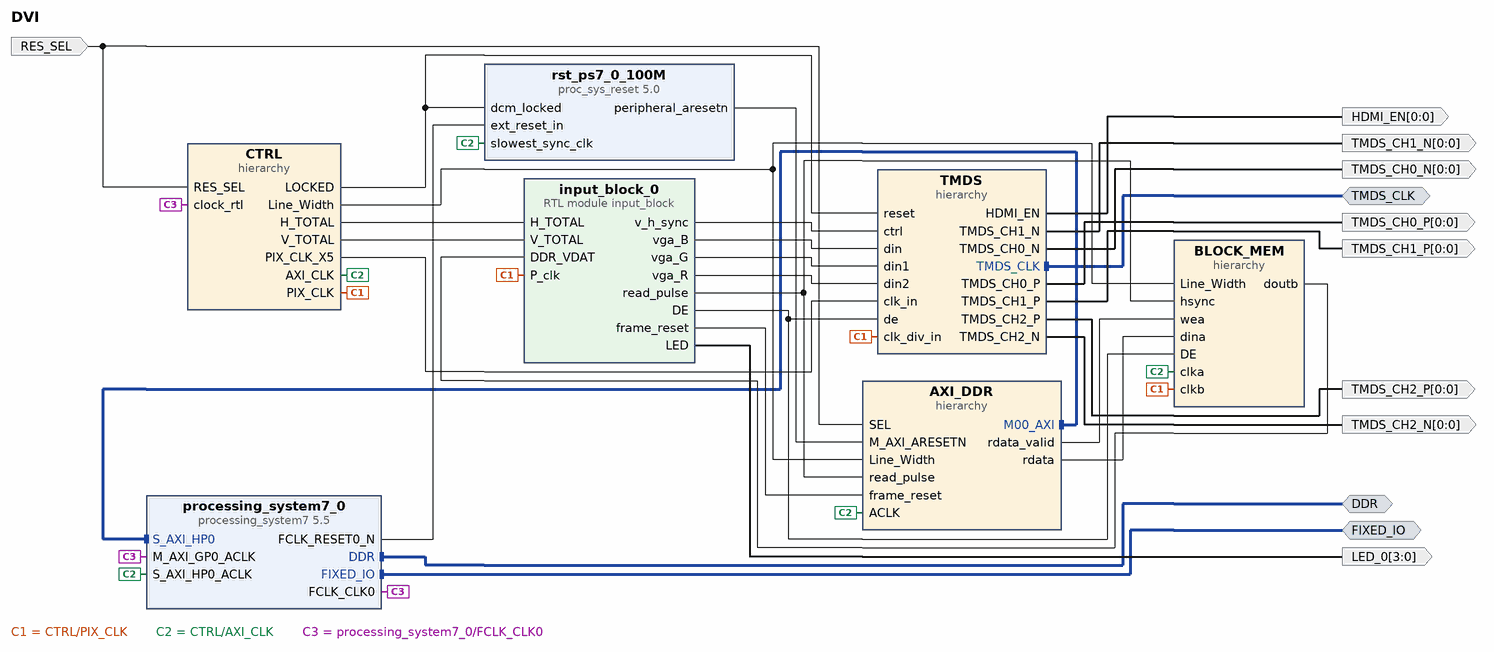
[diagram p0: block diagram of the top level]
# Vivado block design DVI, xc7z010clg400-1, Vivado 2019.2
create_bd_design DVI

create_bd_intf_port -mode Master -vlnv xilinx.com:interface:diff_clock_rtl:1.0 TMDS_CLK
create_bd_intf_port -mode Master -vlnv xilinx.com:display_processing_system7:fixedio_rtl:1.0 FIXED_IO
create_bd_intf_port -mode Master -vlnv xilinx.com:interface:ddrx_rtl:1.0 DDR
create_bd_port -dir O -from 0 -to 0 HDMI_EN
create_bd_port -dir O -from 0 -to 0 TMDS_CH0_N
create_bd_port -dir O -from 0 -to 0 TMDS_CH0_P
create_bd_port -dir O -from 0 -to 0 TMDS_CH1_N
create_bd_port -dir O -from 0 -to 0 TMDS_CH1_P
create_bd_port -dir O -from 0 -to 0 TMDS_CH2_N
create_bd_port -dir O -from 0 -to 0 TMDS_CH2_P
create_bd_port -dir O -from 3 -to 0 LED_0
create_bd_port -dir I -type intr RES_SEL

create_bd_cell -type hier BLOCK_MEM
create_bd_cell -type hier TMDS
create_bd_cell -type hier AXI_DDR
create_bd_cell -type ip -vlnv xilinx.com:ip:processing_system7:5.5 processing_system7_0
set_property -dict [list \
  CONFIG.PCW_APU_PERIPHERAL_FREQMHZ 650 \
  CONFIG.PCW_CRYSTAL_PERIPHERAL_FREQMHZ 50.000000 \
  CONFIG.PCW_ENET0_ENET0_IO {MIO 16 .. 27} \
  CONFIG.PCW_ENET0_GRP_MDIO_ENABLE 1 \
  CONFIG.PCW_ENET0_GRP_MDIO_IO {MIO 52 .. 53} \
  CONFIG.PCW_ENET0_PERIPHERAL_ENABLE 1 \
  CONFIG.PCW_ENET0_RESET_ENABLE 0 \
  CONFIG.PCW_ENET_RESET_ENABLE 1 \
  CONFIG.PCW_ENET_RESET_SELECT {Share reset pin} \
  CONFIG.PCW_FPGA0_PERIPHERAL_FREQMHZ 100 \
  CONFIG.PCW_FPGA1_PERIPHERAL_FREQMHZ 50 \
  CONFIG.PCW_GP0_EN_MODIFIABLE_TXN 0 \
  CONFIG.PCW_GP1_EN_MODIFIABLE_TXN 0 \
  CONFIG.PCW_GPIO_MIO_GPIO_ENABLE 1 \
  CONFIG.PCW_GPIO_MIO_GPIO_IO MIO \
  CONFIG.PCW_I2C_RESET_ENABLE 1 \
  CONFIG.PCW_PERIPHERAL_BOARD_PRESET part0 \
  CONFIG.PCW_PRESET_BANK1_VOLTAGE {LVCMOS 1.8V} \
  CONFIG.PCW_QSPI_GRP_FBCLK_ENABLE 1 \
  CONFIG.PCW_QSPI_GRP_FBCLK_IO {MIO 8} \
  CONFIG.PCW_QSPI_GRP_SINGLE_SS_ENABLE 1 \
  CONFIG.PCW_QSPI_GRP_SINGLE_SS_IO {MIO 1 .. 6} \
  CONFIG.PCW_QSPI_PERIPHERAL_ENABLE 1 \
  CONFIG.PCW_QSPI_QSPI_IO {MIO 1 .. 6} \
  CONFIG.PCW_SD0_GRP_CD_ENABLE 0 \
  CONFIG.PCW_SD0_GRP_WP_ENABLE 1 \
  CONFIG.PCW_SD0_GRP_WP_IO EMIO \
  CONFIG.PCW_SD0_PERIPHERAL_ENABLE 1 \
  CONFIG.PCW_SD0_SD0_IO {MIO 40 .. 45} \
  CONFIG.PCW_SDIO_PERIPHERAL_FREQMHZ 50 \
  CONFIG.PCW_SINGLE_QSPI_DATA_MODE x4 \
  CONFIG.PCW_S_AXI_HP0_DATA_WIDTH 32 \
  CONFIG.PCW_TTC0_PERIPHERAL_ENABLE 1 \
  CONFIG.PCW_TTC0_TTC0_IO EMIO \
  CONFIG.PCW_UART1_PERIPHERAL_ENABLE 1 \
  CONFIG.PCW_UART1_UART1_IO {MIO 48 .. 49} \
  CONFIG.PCW_UART_PERIPHERAL_FREQMHZ 100 \
  CONFIG.PCW_UIPARAM_DDR_FREQ_MHZ 525 \
  CONFIG.PCW_UIPARAM_DDR_PARTNO {MT41K128M16 JT-125} \
  CONFIG.PCW_USB0_PERIPHERAL_ENABLE 1 \
  CONFIG.PCW_USB0_RESET_ENABLE 1 \
  CONFIG.PCW_USB0_RESET_IO {MIO 46} \
  CONFIG.PCW_USB0_USB0_IO {MIO 28 .. 39} \
  CONFIG.PCW_USB_RESET_ENABLE 1 \
  CONFIG.PCW_USB_RESET_SELECT {Share reset pin} \
  CONFIG.PCW_USE_S_AXI_HP0 1 \
] [get_bd_cells processing_system7_0]
# 503 more settings of processing_system7_0 are not shown: defaults, MIO pin electricals, DDR timing, and values the tool derives
create_bd_cell -type ip -vlnv xilinx.com:ip:proc_sys_reset:5.0 rst_ps7_0_100M
create_bd_cell -type hier CTRL
create_bd_cell -type module -reference input_block input_block_0

# ---- hierarchy /BLOCK_MEM ----
current_bd_instance /BLOCK_MEM
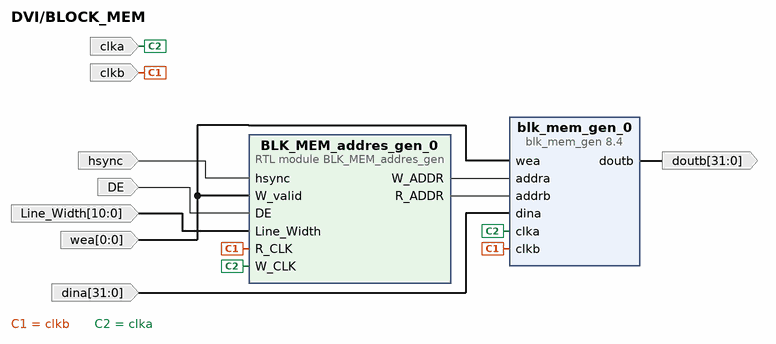
[diagram p1: block diagram inside /BLOCK_MEM]
create_bd_pin -dir O -from 31 -to 0 doutb
create_bd_pin -dir I -type clk clkb
create_bd_pin -dir I -type clk clka
create_bd_pin -dir I -from 31 -to 0 dina
create_bd_pin -dir I -from 0 -to 0 wea
create_bd_pin -dir I hsync
create_bd_pin -dir I DE
create_bd_pin -dir I -from 10 -to 0 Line_Width

create_bd_cell -type ip -vlnv xilinx.com:ip:blk_mem_gen:8.4 blk_mem_gen_0
set_property -dict [list \
  CONFIG.Enable_32bit_Address false \
  CONFIG.Enable_A Always_Enabled \
  CONFIG.Enable_B Always_Enabled \
  CONFIG.Memory_Type Simple_Dual_Port_RAM \
  CONFIG.Operating_Mode_A WRITE_FIRST \
  CONFIG.Port_B_Clock 100 \
  CONFIG.Port_B_Enable_Rate 100 \
  CONFIG.Read_Width_B 32 \
  CONFIG.Register_PortB_Output_of_Memory_Primitives true \
  CONFIG.Use_Byte_Write_Enable false \
  CONFIG.Write_Depth_A 1280 \
  CONFIG.Write_Width_A 32 \
  CONFIG.Write_Width_B 32 \
  CONFIG.use_bram_block Stand_Alone \
] [get_bd_cells blk_mem_gen_0]
create_bd_cell -type module -reference BLK_MEM_addres_gen BLK_MEM_addres_gen_0

# ---- hierarchy /TMDS ----
current_bd_instance /TMDS
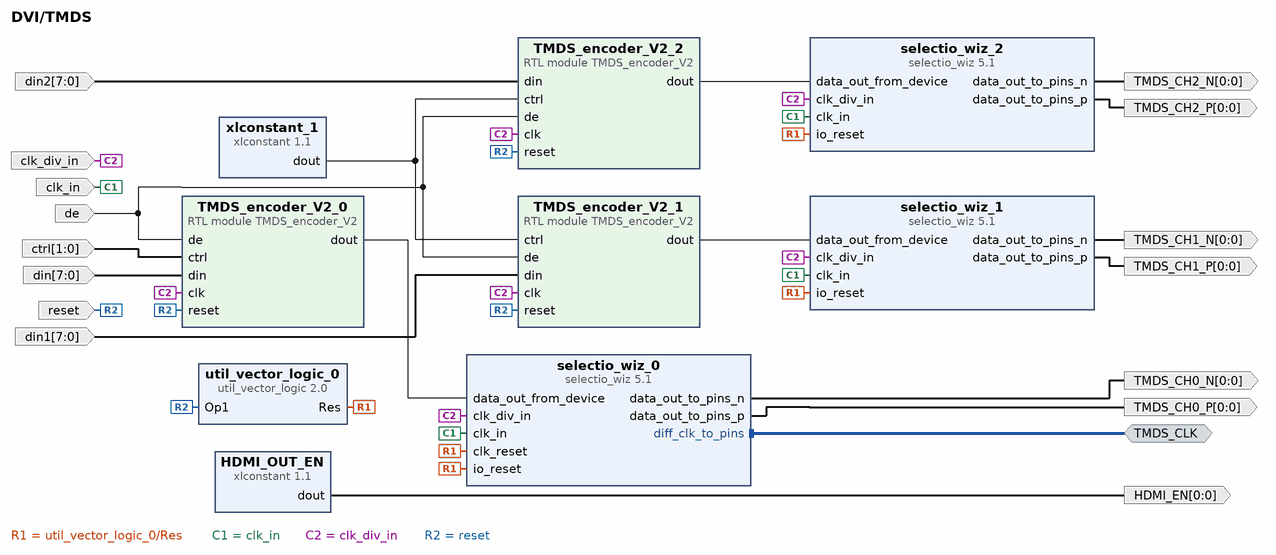
[diagram p2: block diagram inside /TMDS]
create_bd_intf_pin -mode Master -vlnv xilinx.com:interface:diff_clock_rtl:1.0 TMDS_CLK
create_bd_pin -dir O -from 0 -to 0 TMDS_CH2_P
create_bd_pin -dir O -from 0 -to 0 TMDS_CH2_N
create_bd_pin -dir I -type clk clk_in
create_bd_pin -dir I clk_div_in
create_bd_pin -dir I -type rst reset
create_bd_pin -dir I de
create_bd_pin -dir I -from 1 -to 0 ctrl
create_bd_pin -dir I -from 7 -to 0 din
create_bd_pin -dir I -from 7 -to 0 din1
create_bd_pin -dir I -from 7 -to 0 din2
create_bd_pin -dir O -from 0 -to 0 TMDS_CH0_P
create_bd_pin -dir O -from 0 -to 0 TMDS_CH0_N
create_bd_pin -dir O -from 0 -to 0 TMDS_CH1_P
create_bd_pin -dir O -from 0 -to 0 TMDS_CH1_N
create_bd_pin -dir O -from 0 -to 0 HDMI_EN

create_bd_cell -type ip -vlnv xilinx.com:ip:selectio_wiz:5.1 selectio_wiz_2
set_property -dict [list \
  CONFIG.BUS_DIR OUTPUTS \
  CONFIG.BUS_IO_STD TMDS_33 \
  CONFIG.BUS_SIG_TYPE DIFF \
  CONFIG.CLK_FWD false \
  CONFIG.CLK_FWD_IO_STD TMDS_33 \
  CONFIG.CLK_FWD_SIG_TYPE DIFF \
  CONFIG.SELIO_ACTIVE_EDGE DDR \
  CONFIG.SELIO_BUS_IN_DELAY NONE \
  CONFIG.SELIO_CLK_BUF MMCM \
  CONFIG.SELIO_CLK_IO_STD TMDS_33 \
  CONFIG.SELIO_CLK_SIG_TYPE DIFF \
  CONFIG.SELIO_INTERFACE_TYPE NETWORKING \
  CONFIG.SERIALIZATION_FACTOR 10 \
  CONFIG.SYSTEM_DATA_WIDTH 1 \
  CONFIG.USE_SERIALIZATION true \
] [get_bd_cells selectio_wiz_2]
create_bd_cell -type ip -vlnv xilinx.com:ip:util_vector_logic:2.0 util_vector_logic_0
set_property -dict {CONFIG.C_OPERATION not CONFIG.C_SIZE 1} [get_bd_cells util_vector_logic_0]
create_bd_cell -type ip -vlnv xilinx.com:ip:xlconstant:1.1 xlconstant_1
set_property -dict {CONFIG.CONST_VAL 00 CONFIG.CONST_WIDTH 2} [get_bd_cells xlconstant_1]
create_bd_cell -type module -reference TMDS_encoder_V2 TMDS_encoder_V2_0
create_bd_cell -type module -reference TMDS_encoder_V2 TMDS_encoder_V2_1
create_bd_cell -type module -reference TMDS_encoder_V2 TMDS_encoder_V2_2
create_bd_cell -type ip -vlnv xilinx.com:ip:selectio_wiz:5.1 selectio_wiz_0
set_property -dict [list \
  CONFIG.BUS_DIR OUTPUTS \
  CONFIG.BUS_IO_STD TMDS_33 \
  CONFIG.BUS_SIG_TYPE DIFF \
  CONFIG.CLK_FWD true \
  CONFIG.CLK_FWD_IO_STD TMDS_33 \
  CONFIG.CLK_FWD_SER true \
  CONFIG.CLK_FWD_SIG_TYPE DIFF \
  CONFIG.SELIO_ACTIVE_EDGE DDR \
  CONFIG.SELIO_BUS_IN_DELAY NONE \
  CONFIG.SELIO_CLK_BUF MMCM \
  CONFIG.SELIO_CLK_IO_STD TMDS_33 \
  CONFIG.SELIO_CLK_SIG_TYPE DIFF \
  CONFIG.SELIO_INTERFACE_TYPE NETWORKING \
  CONFIG.SERIALIZATION_FACTOR 10 \
  CONFIG.SYSTEM_DATA_WIDTH 1 \
  CONFIG.USE_SERIALIZATION true \
] [get_bd_cells selectio_wiz_0]
create_bd_cell -type ip -vlnv xilinx.com:ip:selectio_wiz:5.1 selectio_wiz_1
set_property -dict [list \
  CONFIG.BUS_DIR OUTPUTS \
  CONFIG.BUS_IO_STD TMDS_33 \
  CONFIG.BUS_SIG_TYPE DIFF \
  CONFIG.CLK_FWD false \
  CONFIG.CLK_FWD_IO_STD TMDS_33 \
  CONFIG.CLK_FWD_SIG_TYPE DIFF \
  CONFIG.SELIO_ACTIVE_EDGE DDR \
  CONFIG.SELIO_BUS_IN_DELAY NONE \
  CONFIG.SELIO_CLK_BUF MMCM \
  CONFIG.SELIO_CLK_IO_STD TMDS_33 \
  CONFIG.SELIO_CLK_SIG_TYPE DIFF \
  CONFIG.SELIO_INTERFACE_TYPE NETWORKING \
  CONFIG.SERIALIZATION_FACTOR 10 \
  CONFIG.SYSTEM_DATA_WIDTH 1 \
  CONFIG.USE_SERIALIZATION true \
] [get_bd_cells selectio_wiz_1]
create_bd_cell -type ip -vlnv xilinx.com:ip:xlconstant:1.1 HDMI_OUT_EN

# ---- hierarchy /AXI_DDR ----
current_bd_instance /AXI_DDR
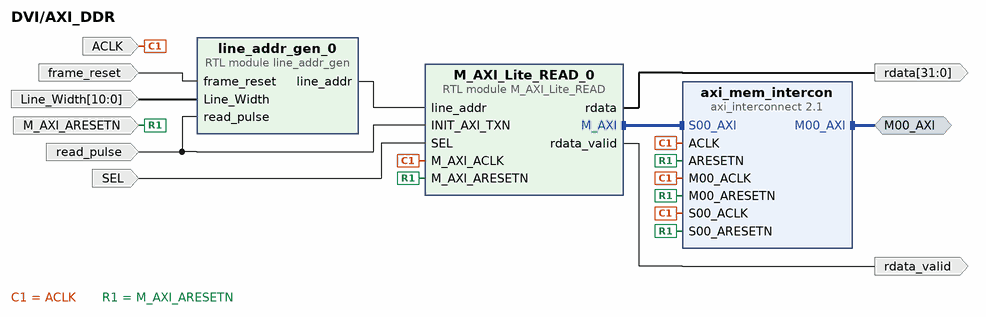
[diagram p3: block diagram inside /AXI_DDR]
create_bd_intf_pin -mode Master -vlnv xilinx.com:interface:aximm_rtl:1.0 M00_AXI
create_bd_pin -dir I -type rst frame_reset
create_bd_pin -dir I -type rst M_AXI_ARESETN
create_bd_pin -dir I -type clk ACLK
create_bd_pin -dir O -from 31 -to 0 rdata
create_bd_pin -dir O rdata_valid
create_bd_pin -dir I read_pulse
create_bd_pin -dir I -from 10 -to 0 Line_Width
create_bd_pin -dir I SEL

create_bd_cell -type ip -vlnv xilinx.com:ip:axi_interconnect:2.1 axi_mem_intercon
set_property -dict {CONFIG.NUM_MI 1} [get_bd_cells axi_mem_intercon]
create_bd_cell -type module -reference line_addr_gen line_addr_gen_0
create_bd_cell -type module -reference M_AXI_Lite_READ M_AXI_Lite_READ_0
set_property -dict {CONFIG.C_M_AXI_DATA_WIDTH 32 CONFIG.C_M_BURST_LEN 128} [get_bd_cells M_AXI_Lite_READ_0]

# ---- hierarchy /CTRL ----
current_bd_instance /CTRL
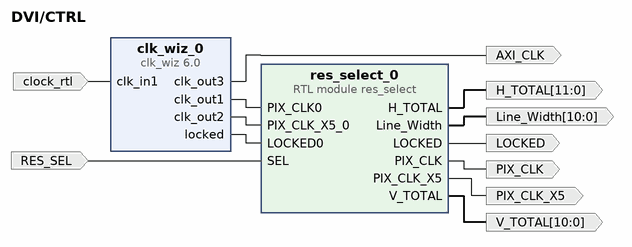
[diagram p4: block diagram inside /CTRL]
create_bd_pin -dir O -type clk AXI_CLK
create_bd_pin -dir O -type clk PIX_CLK
create_bd_pin -dir O PIX_CLK_X5
create_bd_pin -dir O LOCKED
create_bd_pin -dir O -from 10 -to 0 Line_Width
create_bd_pin -dir O -from 11 -to 0 H_TOTAL
create_bd_pin -dir O -from 10 -to 0 V_TOTAL
create_bd_pin -dir I -type clk clock_rtl
create_bd_pin -dir I RES_SEL

create_bd_cell -type module -reference res_select res_select_0
create_bd_cell -type ip -vlnv xilinx.com:ip:clk_wiz:6.0 clk_wiz_0
set_property -dict [list \
  CONFIG.CLKOUT1_DRIVES BUFG \
  CONFIG.CLKOUT1_JITTER 230.405 \
  CONFIG.CLKOUT1_PHASE_ERROR 317.963 \
  CONFIG.CLKOUT1_REQUESTED_OUT_FREQ 25.2 \
  CONFIG.CLKOUT2_DRIVES BUFG \
  CONFIG.CLKOUT2_JITTER 184.176 \
  CONFIG.CLKOUT2_PHASE_ERROR 317.963 \
  CONFIG.CLKOUT2_REQUESTED_OUT_FREQ 126 \
  CONFIG.CLKOUT2_USED true \
  CONFIG.CLKOUT3_DRIVES BUFG \
  CONFIG.CLKOUT3_JITTER 168.070 \
  CONFIG.CLKOUT3_PHASE_ERROR 317.963 \
  CONFIG.CLKOUT3_REQUESTED_OUT_FREQ 250 \
  CONFIG.CLKOUT3_USED true \
  CONFIG.CLKOUT4_DRIVES BUFG \
  CONFIG.CLKOUT5_DRIVES BUFG \
  CONFIG.CLKOUT6_DRIVES BUFG \
  CONFIG.CLKOUT7_DRIVES BUFG \
  CONFIG.CLK_IN1_BOARD_INTERFACE Custom \
  CONFIG.MMCM_BANDWIDTH OPTIMIZED \
  CONFIG.MMCM_CLKFBOUT_MULT_F 63 \
  CONFIG.MMCM_CLKIN1_PERIOD 10.000 \
  CONFIG.MMCM_CLKIN2_PERIOD 10.000 \
  CONFIG.MMCM_CLKOUT0_DIVIDE_F 50 \
  CONFIG.MMCM_CLKOUT1_DIVIDE 10 \
  CONFIG.MMCM_CLKOUT2_DIVIDE 5 \
  CONFIG.MMCM_COMPENSATION INTERNAL \
  CONFIG.MMCM_DIVCLK_DIVIDE 5 \
  CONFIG.NUM_OUT_CLKS 3 \
  CONFIG.OVERRIDE_MMCM true \
  CONFIG.PRIMITIVE PLL \
  CONFIG.USE_BOARD_FLOW true \
  CONFIG.USE_LOCKED true \
  CONFIG.USE_RESET false \
] [get_bd_cells clk_wiz_0]

# ---- connections ----

current_bd_instance /BLOCK_MEM
connect_bd_net -net PL_HDMI_PIX_CLK_PH_0 [get_bd_pins clkb] [get_bd_pins blk_mem_gen_0/clkb] [get_bd_pins BLK_MEM_addres_gen_0/R_CLK]
connect_bd_net -net ACLK_1 [get_bd_pins clka] [get_bd_pins blk_mem_gen_0/clka] [get_bd_pins BLK_MEM_addres_gen_0/W_CLK]
connect_bd_net -net M_AXI_Lite_READ_0_rdata_valid [get_bd_pins wea] [get_bd_pins blk_mem_gen_0/wea] [get_bd_pins BLK_MEM_addres_gen_0/W_valid]
connect_bd_net -net M_AXI_Lite_READ_0_rdata [get_bd_pins dina] [get_bd_pins blk_mem_gen_0/dina]
connect_bd_net [get_bd_pins blk_mem_gen_0/doutb] [get_bd_pins doutb]
connect_bd_net [get_bd_pins BLK_MEM_addres_gen_0/W_ADDR] [get_bd_pins blk_mem_gen_0/addra]
connect_bd_net [get_bd_pins BLK_MEM_addres_gen_0/R_ADDR] [get_bd_pins blk_mem_gen_0/addrb]
connect_bd_net [get_bd_pins hsync] [get_bd_pins BLK_MEM_addres_gen_0/hsync]
connect_bd_net [get_bd_pins DE] [get_bd_pins BLK_MEM_addres_gen_0/DE]
connect_bd_net [get_bd_pins Line_Width] [get_bd_pins BLK_MEM_addres_gen_0/Line_Width]

current_bd_instance /TMDS
connect_bd_intf_net -intf_net PL_HDMI_TMDS_CLK [get_bd_intf_pins TMDS_CLK] [get_bd_intf_pins selectio_wiz_0/diff_clk_to_pins]
connect_bd_net [get_bd_pins TMDS_encoder_V2_2/dout] [get_bd_pins selectio_wiz_2/data_out_from_device]
connect_bd_net [get_bd_pins util_vector_logic_0/Res] \
  [get_bd_pins selectio_wiz_0/io_reset] [get_bd_pins selectio_wiz_0/clk_reset] [get_bd_pins selectio_wiz_2/io_reset] \
  [get_bd_pins selectio_wiz_1/io_reset]
connect_bd_net [get_bd_pins xlconstant_1/dout] [get_bd_pins TMDS_encoder_V2_1/ctrl] [get_bd_pins TMDS_encoder_V2_2/ctrl]
connect_bd_net [get_bd_pins TMDS_encoder_V2_0/dout] [get_bd_pins selectio_wiz_0/data_out_from_device]
connect_bd_net [get_bd_pins TMDS_encoder_V2_1/dout] [get_bd_pins selectio_wiz_1/data_out_from_device]
connect_bd_net -net PL_HDMI_TMDS_CH2_P [get_bd_pins selectio_wiz_2/data_out_to_pins_p] [get_bd_pins TMDS_CH2_P]
connect_bd_net -net PL_HDMI_TMDS_CH2_N [get_bd_pins selectio_wiz_2/data_out_to_pins_n] [get_bd_pins TMDS_CH2_N]
connect_bd_net -net res_select_0_PIX_CLK_X5 [get_bd_pins clk_in] \
  [get_bd_pins selectio_wiz_0/clk_in] [get_bd_pins selectio_wiz_1/clk_in] [get_bd_pins selectio_wiz_2/clk_in]
connect_bd_net -net res_select_0_PIX_CLK [get_bd_pins clk_div_in] \
  [get_bd_pins selectio_wiz_0/clk_div_in] [get_bd_pins selectio_wiz_1/clk_div_in] [get_bd_pins TMDS_encoder_V2_0/clk] \
  [get_bd_pins TMDS_encoder_V2_1/clk] [get_bd_pins TMDS_encoder_V2_2/clk] [get_bd_pins selectio_wiz_2/clk_div_in]
connect_bd_net -net res_select_0_LOCKED [get_bd_pins reset] \
  [get_bd_pins TMDS_encoder_V2_0/reset] [get_bd_pins TMDS_encoder_V2_1/reset] [get_bd_pins TMDS_encoder_V2_2/reset] \
  [get_bd_pins util_vector_logic_0/Op1]
connect_bd_net -net input_block_0_DE_TMDS [get_bd_pins de] \
  [get_bd_pins TMDS_encoder_V2_1/de] [get_bd_pins TMDS_encoder_V2_2/de] [get_bd_pins TMDS_encoder_V2_0/de]
connect_bd_net -net input_block_0_v_h_sync [get_bd_pins ctrl] [get_bd_pins TMDS_encoder_V2_0/ctrl]
connect_bd_net -net input_block_0_vga_B [get_bd_pins din] [get_bd_pins TMDS_encoder_V2_0/din]
connect_bd_net -net input_block_0_vga_G [get_bd_pins din1] [get_bd_pins TMDS_encoder_V2_1/din]
connect_bd_net -net input_block_0_vga_R [get_bd_pins din2] [get_bd_pins TMDS_encoder_V2_2/din]
connect_bd_net -net PL_HDMI_TMDS_CH0_P [get_bd_pins selectio_wiz_0/data_out_to_pins_p] [get_bd_pins TMDS_CH0_P]
connect_bd_net -net PL_HDMI_TMDS_CH0_N [get_bd_pins selectio_wiz_0/data_out_to_pins_n] [get_bd_pins TMDS_CH0_N]
connect_bd_net -net PL_HDMI_TMDS_CH1_P [get_bd_pins selectio_wiz_1/data_out_to_pins_p] [get_bd_pins TMDS_CH1_P]
connect_bd_net -net PL_HDMI_TMDS_CH1_N [get_bd_pins selectio_wiz_1/data_out_to_pins_n] [get_bd_pins TMDS_CH1_N]
connect_bd_net -net PL_HDMI_HDMI_EN [get_bd_pins HDMI_OUT_EN/dout] [get_bd_pins HDMI_EN]

current_bd_instance /AXI_DDR
connect_bd_intf_net [get_bd_intf_pins M_AXI_Lite_READ_0/M_AXI] [get_bd_intf_pins axi_mem_intercon/S00_AXI]
connect_bd_intf_net [get_bd_intf_pins M00_AXI] [get_bd_intf_pins axi_mem_intercon/M00_AXI]
connect_bd_net [get_bd_pins line_addr_gen_0/line_addr] [get_bd_pins M_AXI_Lite_READ_0/line_addr]
connect_bd_net -net PL_HDMI_frame_reset [get_bd_pins frame_reset] [get_bd_pins line_addr_gen_0/frame_reset]
connect_bd_net [get_bd_pins ACLK] \
  [get_bd_pins axi_mem_intercon/ACLK] [get_bd_pins axi_mem_intercon/S00_ACLK] [get_bd_pins axi_mem_intercon/M00_ACLK] \
  [get_bd_pins M_AXI_Lite_READ_0/M_AXI_ACLK]
connect_bd_net [get_bd_pins M_AXI_Lite_READ_0/rdata] [get_bd_pins rdata]
connect_bd_net [get_bd_pins M_AXI_Lite_READ_0/rdata_valid] [get_bd_pins rdata_valid]
connect_bd_net [get_bd_pins read_pulse] [get_bd_pins line_addr_gen_0/read_pulse] [get_bd_pins M_AXI_Lite_READ_0/INIT_AXI_TXN]
connect_bd_net -net res_select_0_LOCKED [get_bd_pins M_AXI_ARESETN] \
  [get_bd_pins axi_mem_intercon/S00_ARESETN] [get_bd_pins axi_mem_intercon/M00_ARESETN] \
  [get_bd_pins axi_mem_intercon/ARESETN] [get_bd_pins M_AXI_Lite_READ_0/M_AXI_ARESETN]
connect_bd_net [get_bd_pins Line_Width] [get_bd_pins line_addr_gen_0/Line_Width]
connect_bd_net -net RES_SEL_1 [get_bd_pins SEL] [get_bd_pins M_AXI_Lite_READ_0/SEL]

current_bd_instance /CTRL
connect_bd_net [get_bd_pins res_select_0/PIX_CLK] [get_bd_pins PIX_CLK]
connect_bd_net [get_bd_pins res_select_0/PIX_CLK_X5] [get_bd_pins PIX_CLK_X5]
connect_bd_net [get_bd_pins res_select_0/LOCKED] [get_bd_pins LOCKED]
connect_bd_net [get_bd_pins res_select_0/Line_Width] [get_bd_pins Line_Width]
connect_bd_net [get_bd_pins res_select_0/H_TOTAL] [get_bd_pins H_TOTAL]
connect_bd_net [get_bd_pins res_select_0/V_TOTAL] [get_bd_pins V_TOTAL]
connect_bd_net [get_bd_pins clock_rtl] [get_bd_pins clk_wiz_0/clk_in1]
connect_bd_net [get_bd_pins clk_wiz_0/clk_out1] [get_bd_pins res_select_0/PIX_CLK0]
connect_bd_net [get_bd_pins clk_wiz_0/clk_out2] [get_bd_pins res_select_0/PIX_CLK_X5_0]
connect_bd_net [get_bd_pins clk_wiz_0/clk_out3] [get_bd_pins AXI_CLK]
connect_bd_net [get_bd_pins clk_wiz_0/locked] [get_bd_pins res_select_0/LOCKED0]
connect_bd_net [get_bd_pins RES_SEL] [get_bd_pins res_select_0/SEL]

current_bd_instance /
connect_bd_intf_net [get_bd_intf_ports DDR] [get_bd_intf_pins processing_system7_0/DDR]
connect_bd_intf_net -intf_net PL_HDMI_TMDS_CLK [get_bd_intf_ports TMDS_CLK] [get_bd_intf_pins TMDS/TMDS_CLK]
connect_bd_intf_net -intf_net axi_mem_intercon_M00_AXI [get_bd_intf_pins AXI_DDR/M00_AXI] [get_bd_intf_pins processing_system7_0/S_AXI_HP0]
connect_bd_intf_net [get_bd_intf_ports FIXED_IO] [get_bd_intf_pins processing_system7_0/FIXED_IO]
connect_bd_net -net PL_HDMI_HDMI_EN [get_bd_pins TMDS/HDMI_EN] [get_bd_ports HDMI_EN]
connect_bd_net -net PL_HDMI_TMDS_CH1_N [get_bd_pins TMDS/TMDS_CH1_N] [get_bd_ports TMDS_CH1_N]
connect_bd_net -net PL_HDMI_TMDS_CH1_P [get_bd_pins TMDS/TMDS_CH1_P] [get_bd_ports TMDS_CH1_P]
connect_bd_net -net PL_HDMI_TMDS_CH2_P [get_bd_pins TMDS/TMDS_CH2_P] [get_bd_ports TMDS_CH2_P]
connect_bd_net -net PL_HDMI_TMDS_CH0_P [get_bd_pins TMDS/TMDS_CH0_P] [get_bd_ports TMDS_CH0_P]
connect_bd_net -net PL_HDMI_TMDS_CH0_N [get_bd_pins TMDS/TMDS_CH0_N] [get_bd_ports TMDS_CH0_N]
connect_bd_net -net PL_HDMI_TMDS_CH2_N [get_bd_pins TMDS/TMDS_CH2_N] [get_bd_ports TMDS_CH2_N]
connect_bd_net -net PL_HDMI_LED_0 [get_bd_pins input_block_0/LED] [get_bd_ports LED_0]
connect_bd_net -net blk_mem_gen_0_doutb [get_bd_pins BLOCK_MEM/doutb] [get_bd_pins input_block_0/DDR_VDAT]
connect_bd_net -net M_AXI_Lite_READ_0_rdata_valid [get_bd_pins AXI_DDR/rdata_valid] [get_bd_pins BLOCK_MEM/wea]
connect_bd_net -net PL_HDMI_frame_reset [get_bd_pins input_block_0/frame_reset] [get_bd_pins AXI_DDR/frame_reset]
connect_bd_net -net res_select_0_PIX_CLK [get_bd_pins CTRL/PIX_CLK] \
  [get_bd_pins BLOCK_MEM/clkb] [get_bd_pins TMDS/clk_div_in] [get_bd_pins input_block_0/P_clk]
connect_bd_net [get_bd_pins input_block_0/v_h_sync] [get_bd_pins TMDS/ctrl]
connect_bd_net [get_bd_pins input_block_0/vga_B] [get_bd_pins TMDS/din]
connect_bd_net [get_bd_pins input_block_0/vga_G] [get_bd_pins TMDS/din1]
connect_bd_net [get_bd_pins input_block_0/vga_R] [get_bd_pins TMDS/din2]
connect_bd_net [get_bd_pins input_block_0/DE] [get_bd_pins BLOCK_MEM/DE] [get_bd_pins TMDS/de]
connect_bd_net [get_bd_pins input_block_0/read_pulse] [get_bd_pins AXI_DDR/read_pulse] [get_bd_pins BLOCK_MEM/hsync]
connect_bd_net -net M_AXI_Lite_READ_0_rdata [get_bd_pins AXI_DDR/rdata] [get_bd_pins BLOCK_MEM/dina]
connect_bd_net [get_bd_pins processing_system7_0/FCLK_RESET0_N] [get_bd_pins rst_ps7_0_100M/ext_reset_in]
connect_bd_net -net CLK_CTRL_AXI_CLK [get_bd_pins CTRL/AXI_CLK] \
  [get_bd_pins BLOCK_MEM/clka] [get_bd_pins rst_ps7_0_100M/slowest_sync_clk] [get_bd_pins AXI_DDR/ACLK] \
  [get_bd_pins processing_system7_0/S_AXI_HP0_ACLK]
connect_bd_net -net CLK_CTRL_LOCKED [get_bd_pins CTRL/LOCKED] [get_bd_pins rst_ps7_0_100M/dcm_locked] [get_bd_pins TMDS/reset]
connect_bd_net [get_bd_pins processing_system7_0/FCLK_CLK0] [get_bd_pins processing_system7_0/M_AXI_GP0_ACLK] [get_bd_pins CTRL/clock_rtl]
connect_bd_net -net M_AXI_ARESETN_1 [get_bd_pins rst_ps7_0_100M/peripheral_aresetn] [get_bd_pins AXI_DDR/M_AXI_ARESETN]
connect_bd_net -net res_select_0_PIX_CLK_X5 [get_bd_pins CTRL/PIX_CLK_X5] [get_bd_pins TMDS/clk_in]
connect_bd_net -net xlconstant_0_dout [get_bd_ports RES_SEL] [get_bd_pins AXI_DDR/SEL] [get_bd_pins CTRL/RES_SEL]
connect_bd_net [get_bd_pins CTRL/Line_Width] [get_bd_pins BLOCK_MEM/Line_Width] [get_bd_pins AXI_DDR/Line_Width]
connect_bd_net [get_bd_pins CTRL/H_TOTAL] [get_bd_pins input_block_0/H_TOTAL]
connect_bd_net [get_bd_pins CTRL/V_TOTAL] [get_bd_pins input_block_0/V_TOTAL]
set_property HDL_ATTRIBUTE.BMM_INFO_PROCESSOR {arm > DVI axi_bram_ctrl_0} [get_bd_cells processing_system7_0]
set_property HDL_ATTRIBUTE.KEEP_HIERARCHY yes [get_bd_cells processing_system7_0]

# ---- address map ----
assign_bd_address -offset 0x00000000 -range 512M -target_address_space [get_bd_addr_spaces AXI_DDR/M_AXI_Lite_READ_0/M_AXI] [get_bd_addr_segs processing_system7_0/S_AXI_HP0/HP0_DDR_LOWOCM]

validate_bd_design
save_bd_design
